# EAGLE design sword (EAGLE 8.0.1)
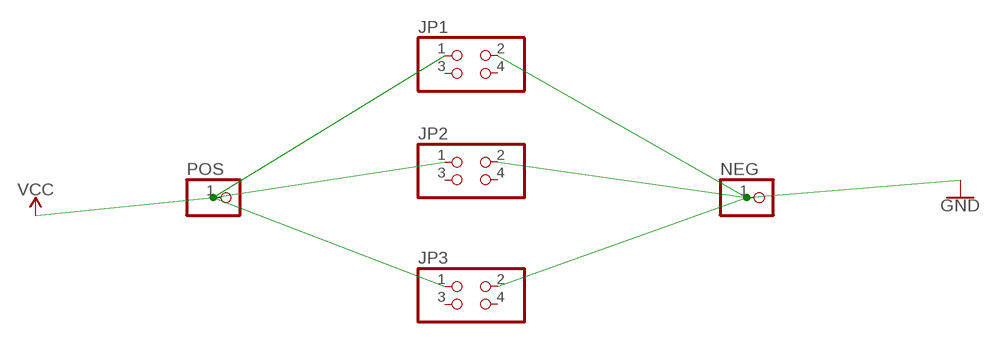
[diagram p0: schematic, sheet 1]

## Parts
JP1  PINHD-2X2  [2X02]
JP2  PINHD-2X2  [2X02]
JP3  PINHD-2X2  [2X02]
NEG  PINHD-1X1  [1X01]
POS  PINHD-1X1  [1X01]

## Nets
GND: JP1.2 JP2.2 JP3.2 NEG.1
VCC: JP1.1 JP2.1 JP3.1 POS.1
Unconnected: JP1.3 JP1.4 JP2.3 JP2.4 JP3.3 JP3.4

## Library data of the parts
JP1-JP3 = pinhead:PINHD-2X2: PIN HEADER
NEG POS = pinhead:PINHD-1X1: PIN HEADER

## Board
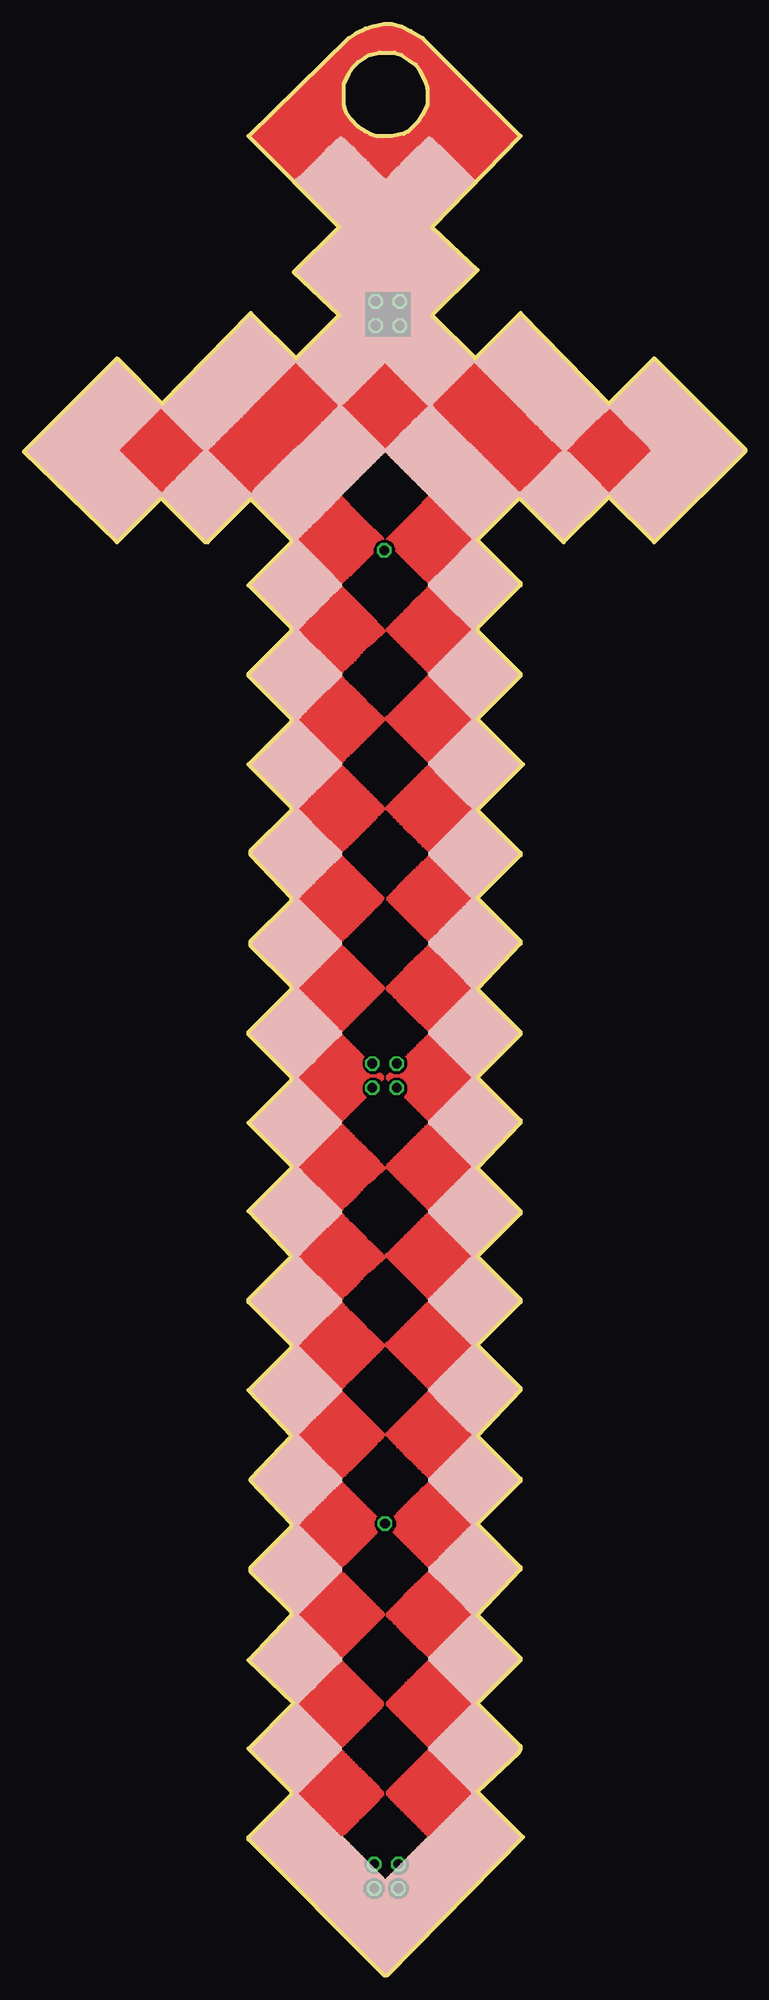
[diagram p1: board, top side]
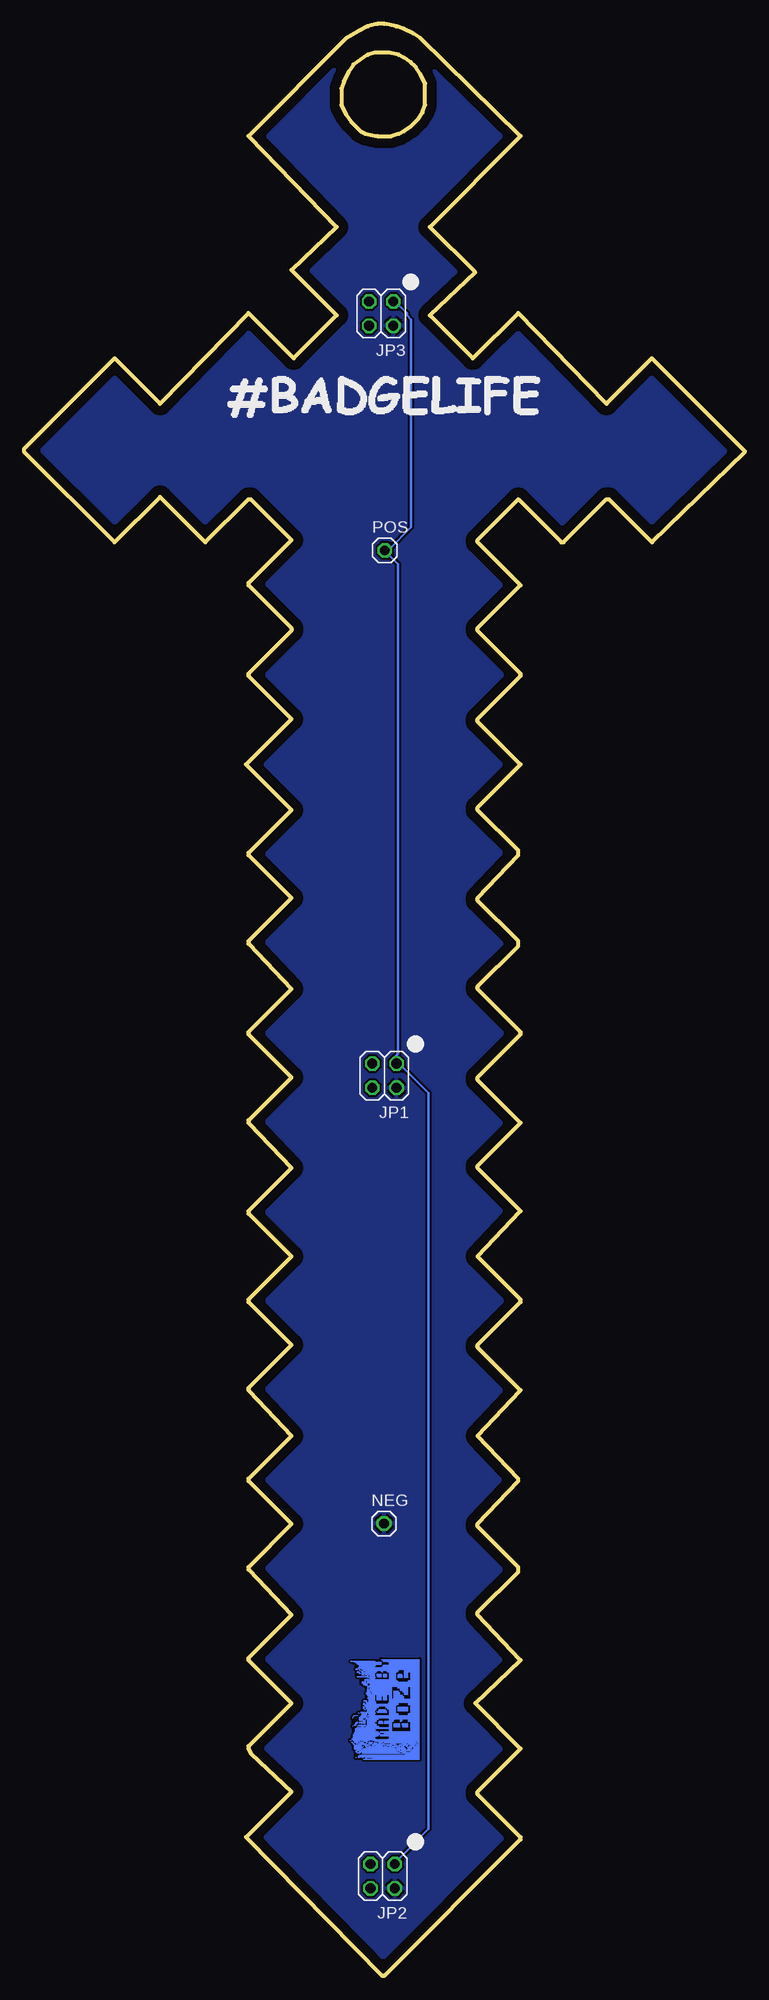
[diagram p2: board, bottom side, seen from below]

Size 75.5 x 204.25 mm. Coordinates in mm from the lower left corner, seen from the top.
Outline: 0,159.5 9.75,169.25 14.5,164.5 23.75,174 28.5,169.25 33,173.75 28.25,178.25 33,183 23.5,192.5 34,202.75 34.75,203.25 35.75,203.75 36.5,204 37.75,204.25 38.5,204.25 39.5,204 40.5,203.5 41.75,202.75 52,192.5 42.75,183 47.5,178.5 42.75,173.75 47.25,169.25 52,174 61.25,164.5 66,169.25 75.5,159.75 75.5,159.5 66,150 61.25,154.75 56.5,150 52,154.5 51.75,154.5 47.5,150.25 52,145.75 52,145.5 47.5,141 47.5,140.75 52,136.25 52,136 47.5,131.5 52.25,126.75 47.5,122 52,117.5 52,117.25 47.5,112.75 52,108.25 52,108 47.5,103.25 52,98.75 52,98.5 47.5,94 52,89.5 52,89.25 47.5,84.5 52,80 52,79.75 47.5,75.25 52,70.75 52,70.5 47.5,66 52,61.5 52,61.25 47.5,56.5 52,52 52,51.75 47.5,47.25 52,42.75 52,42.5 47.5,37.75 52,33.25 52,33 47.5,28.5 52,24 52,23.75 51.75,23.25 47.5,19.25 52.25,14.5 38,0 37.75,0 23.5,14.25 23.5,14.5 28,19 28,19.25 23.5,23.75 28.25,28.5 23.5,33 28,37.75 28,38 23.75,42.25 23.75,42.75 28,47 28,47.25 23.75,51.75 23.75,52 28,56.5 23.5,61.25 28,65.75 28,66 23.5,70.5 23.5,70.75 28,75.25 23.5,80 28,84.5 28,84.75 23.5,89.25 28,93.75 28,94 23.5,98.5 23.5,98.75 28,103.25 28,103.5 23.75,107.75 23.75,108.25 28,112.5 28,112.75 23.75,117.25 23.75,117.75 28,122 28,122.25 23.5,126.75 28,131.25 28,131.5 23.5,136 23.5,136.25 28,140.75 28,141 23.5,145.5 28,150 28,150.25 23.75,154.5 19.25,150 19,150 14.5,154.5 14.25,154.5 9.75,150 0,159.5
Outline: 33.5,195.75 33.5,198 34,199 34.5,199.75 35,200.25 35.75,200.75 36.25,201 37.25,201.25 38.75,201.25 39.5,201 41,200 41.5,199.25 42,198.25 42.25,197.5 42.25,195.75 41.75,194.75 41.25,194 40.25,193 39.75,192.75 38.5,192.5 37,192.5 36.25,192.75 35.75,193 35,193.5 34.25,194.25 33.75,195 33.5,195.75
Copper layers (1*16): Top 0.035mm / dielectric 1.5mm / Bottom 0.035mm
Design rules "default": minimum track width 10mil, minimum drill 24mil, track to track 8mil, track to pad 8mil, pad to pad 8mil, via to via 8mil, smd to smd 8mil, copper to edge 40mil, drill to drill 8mil, minimum pad ring 10mil, minimum via ring 8mil, stop-mask expansion 4mil, vias tented up to drill 0mil, thermal gap 10mil

### Footprints (pad centres in the part's own frame; a part is rotated, then mirrored left to right if it is on the bottom)
2X02 = drill 1.016 octagon: 1 -1.27,-1.27; 2 -1.27,1.27; 3 1.27,-1.27; 4 1.27,1.27
1X01 = drill 1.016 octagon: 1 0,0

### Placement (x,y rotation side)
JP1  37.75,94.18 180 bottom
JP2  37.94,10.4 180 bottom
JP3  38.09,173.93 180 bottom
NEG  37.8,47.3 0 bottom
POS  37.72,149.16 0 bottom

### Tracks (layer width: path | path; a pad name or v marks a point on that pad's centre or on a via)
GND
  pour Bottom: 0.25,159.5 9.75,169 14,164.75 14.75,164.75 23.75,173.75 24,173.75 28.5,169.25 33,173.75 28.25,178.5 32.75,183 33.25,183 23.75,192.5 33.75,202.5 34.75,203.25 35.5,203.75 36.25,204 37.5,204.25 38.75,204.25 40.25,203.75 41.75,202.75 43.25,201.25 52,192.5 52.25,192.5 43,183.25 43,183 47.5,178.5 47.5,178.25 43,173.75 43,173.5 47.25,169.25 51.75,173.75 52,173.75 61,164.75 61.5,164.75 65.75,169 66.25,169 75.5,159.75 75.5,159.25 66,149.75 61.25,154.5 56.75,150 56.5,150 52,154.5 51.75,154.5 47.5,150.25 47.5,150 52,145.5 47.5,141 47.5,140.5 52,136 47.5,131.5 52,127 52,126.75 47.5,122.25 47.5,122 52,117.5 52,117.25 47.5,112.75 52,108.25 52,107.75 47.5,103.25 52,98.75 52,98.5 47.5,94 47.5,93.75 52,89.25 47.5,84.75 47.5,84.5 52,80 52,79.75 47.5,75.25 52,70.75 52,70.5 47.5,66 52,61.5 52,61 47.5,56.5 52,52 52,51.75 47.5,47.25 52,42.75 52,42.5 47.5,38 47.5,37.75 52,33.25 52,32.75 47.5,28.25 52,23.75 52,23.5 47.5,19 52,14.5 52,14.25 37.75,0 23.5,14.25 23.5,14.5 28,19 23.5,23.5 23.5,23.75 28,28.25 28,28.5 23.75,32.75 23.75,33.25 28.25,37.75 23.75,42.25 23.75,42.75 28.25,47.25 23.75,51.75 23.75,52 28.25,56.5 23.5,61.25 28,65.75 28,66 23.75,70.25 23.75,70.75 28.25,75.25 23.75,79.75 23.75,80 28,84.25 28,84.75 23.5,89.25 28.25,94 23.5,98.75 28.25,103.5 23.5,108.25 28,112.75 23.5,117.25 23.5,117.5 28.25,122.25 23.5,127 28,131.5 23.75,135.75 23.75,136.5 28.25,141 23.5,145.75 28,150.25 23.75,154.5 19.25,150 19,150 14.25,154.75 9.75,150.25 9.5,150.25
VCC
  Bottom 0.254: JP3.1 36.78,175.36 35.41,173.99 35.41,173.76 34.95,173.3 34.95,151.58 37.24,149.3 37.24,149.07 POS.1 37.24,148.84 37.24,148.61 36.33,147.7 36.33,96.49 36.55,96.26 36.55,95.58 JP1.1 36.33,95.58 33.13,92.38 33.13,15.34 36.55,11.91 36.55,11.68 JP2.1
(copper drawn outside any net)
  shapes: Bottom area x549, Top area x4818